# Altium schematic sheet ULN2003.SchDoc
size A4; SheetNumber: 4; SheetTotal: 6
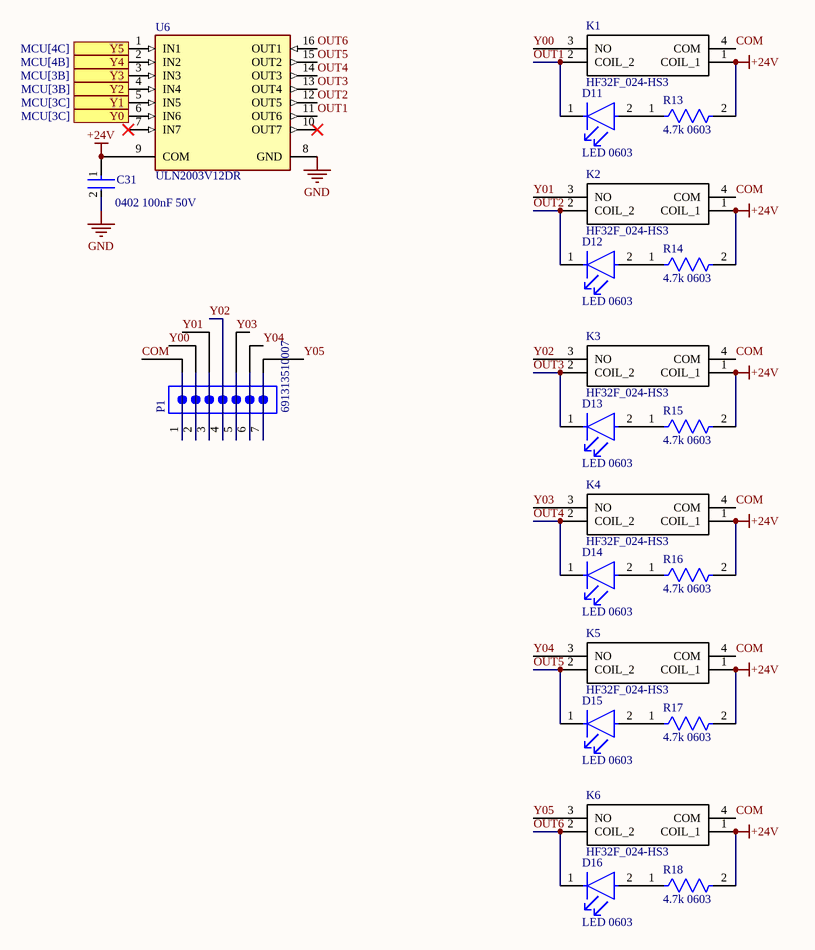
[diagram p0: ULN2003.SchDoc]

## Parts
C31  0402 100nF 50V  [FP-0402B104K500CT-IPC_C]
D11  LED 0603  [FP-LSM0603453V-MFG]
D12  LED 0603  [FP-LSM0603453V-MFG]
D13  LED 0603  [FP-LSM0603453V-MFG]
D14  LED 0603  [FP-LSM0603453V-MFG]
D15  LED 0603  [FP-LSM0603453V-MFG]
D16  LED 0603  [FP-LSM0603453V-MFG]
K1  HF32F_024-HS3  [HF32F024HS3]
K2  HF32F_024-HS3  [HF32F024HS3]
K3  HF32F_024-HS3  [HF32F024HS3]
K4  HF32F_024-HS3  [HF32F024HS3]
K5  HF32F_024-HS3  [HF32F024HS3]
K6  HF32F_024-HS3  [HF32F024HS3]
P1  691313510007  [691313510007]
R13  4.7k 0603  [FP-AC0603-MFG]
R14  4.7k 0603  [FP-AC0603-MFG]
R15  4.7k 0603  [FP-AC0603-MFG]
R16  4.7k 0603  [FP-AC0603-MFG]
R17  4.7k 0603  [FP-AC0603-MFG]
R18  4.7k 0603  [FP-AC0603-MFG]
U6  ULN2003V12DR  [FP-D0016A-MFG]

## Ports
Y0 (in, see MCU[3C]), Y1 (in, see MCU[3C]), Y2 (in, see MCU[3B]), Y3 (in, see MCU[3B]), Y4 (in, see MCU[4B]), Y5 (in, see MCU[4C])

## Nets
+24V: C31.1 K1.1(COIL_1) K2.1(COIL_1) K3.1(COIL_1) K4.1(COIL_1) K5.1(COIL_1) K6.1(COIL_1) R13.2 R14.2 R15.2 R16.2 R17.2 R18.2 U6.9(COM)
GND: C31.2 U6.8(GND)
COM: K1.4(COM) K2.4(COM) K3.4(COM) K4.4(COM) K5.4(COM) K6.4(COM) P1.1
OUT1: D11.1(C) K1.2(COIL_2) U6.11(OUT6)
OUT2: D12.1(C) K2.2(COIL_2) U6.12(OUT5)
OUT3: D13.1(C) K3.2(COIL_2) U6.13(OUT4)
OUT4: D14.1(C) K4.2(COIL_2) U6.14(OUT3)
OUT5: D15.1(C) K5.2(COIL_2) U6.15(OUT2)
OUT6: D16.1(C) K6.2(COIL_2) U6.16(OUT1)
Y0: U6.6(IN6) ; port Y0
Y00: K1.3(NO) P1.2
Y1: U6.5(IN5) ; port Y1
Y01: K2.3(NO) P1.3
Y2: U6.4(IN4) ; port Y2
Y02: K3.3(NO) P1.4
Y3: U6.3(IN3) ; port Y3
Y03: K4.3(NO) P1.5
Y4: U6.2(IN2) ; port Y4
Y04: K5.3(NO) P1.6
Y5: U6.1(IN1) ; port Y5
Y05: K6.3(NO) P1.7
NetD11_2: D11.2(A) R13.1
NetD12_2: D12.2(A) R14.1
NetD13_2: D13.2(A) R15.1
NetD14_2: D14.2(A) R16.1
NetD15_2: D15.2(A) R17.1
NetD16_2: D16.2(A) R18.1

Not connected (* = marked no-connect by the designer): U6 7(IN7)* 10(OUT7)*

## Library data of the parts
C31 = CMP-45632-000010-1: CAP CER 0.1UF 50V X7R 0402; Tolerance: 10%; Max Operating Temperature: 125°C; Case Code (Metric): 1005; RoHS Compliant: Yes; Series: -; Case Code (Imperial): 0402; Voltage Rating: 50V; Min Operating Temperature: -55°C; Mount: Surface Mount; Capacitance: 100nF; Case/Package: 0402; Packaging: Cut Tape
D11-D16 = CMP-00731-94024739-1: LSM0603453V LED SM 0603 3V -/1000/-mcd Green; Forward Current: 20mA; Forward Voltage: 2.3V; Viewing Angle: 120°; Reverse Voltage: 5V; Power Dissipation: 60mW; Wavelength: 576nm; Luminous Intensity: 120mcd; NexarPartId: 94024739; Height: 550µm; Max Operating Temperature: 85°C; Schedule B: 8541402000, 8541406050; Case/Package: 0603; Color: Green; Min Operating Temperature: -40°C
K1-K6 = HF32F_024-HS3: Relay or Contactor; Manufacturer_Name: Hongfa; Manufacturer_Part_Number: HF32F/024-HS3; Datasheet Link: https://source.hongfa.com//Api/DownloadPdf/265; Height: 15.8mm
P1 = CMP-1502-02197-3: Terminal Block, 5.08MM Pitch, Close Horizontal Pcb Header, 300VAC, 7 Pins
R13-R18 = CMP-03412-049129-1: RES 4.7kΩ 1.00% 0.2W 0603
U6 = CMP-04912-000075-1: MOSFET 7CH 16SOIC; Power Dissipation: 860mW; Output Current: 140mA; Collector Emitter Voltage (VCEO): 20V; Collector Emitter Saturation Voltage: 750mV; Output Voltage: 16V; Number of Drivers: 7; Number of Pins: 16; RoHS Compliant: Yes; Height: 1.5mm; Package Quantity: 1; REACH SVHC: No SVHC; Series: -; Min Operating Temperature: -40°C; Max Power Dissipation: 860mW; Max Collector Current: 140mA; Mount: Surface Mount; Packaging: Tape and Reel; Radiation Hardening: No; Case/Package: SOIC; Max Operating Temperature: 85°C; Number of Outputs: 7; Lead Free: Lead Free; Width: 4mm; Weight: 0.004998oz; Length: 10mm